# EAGLE schematic FridgeExtender (EAGLE 9.7.0)
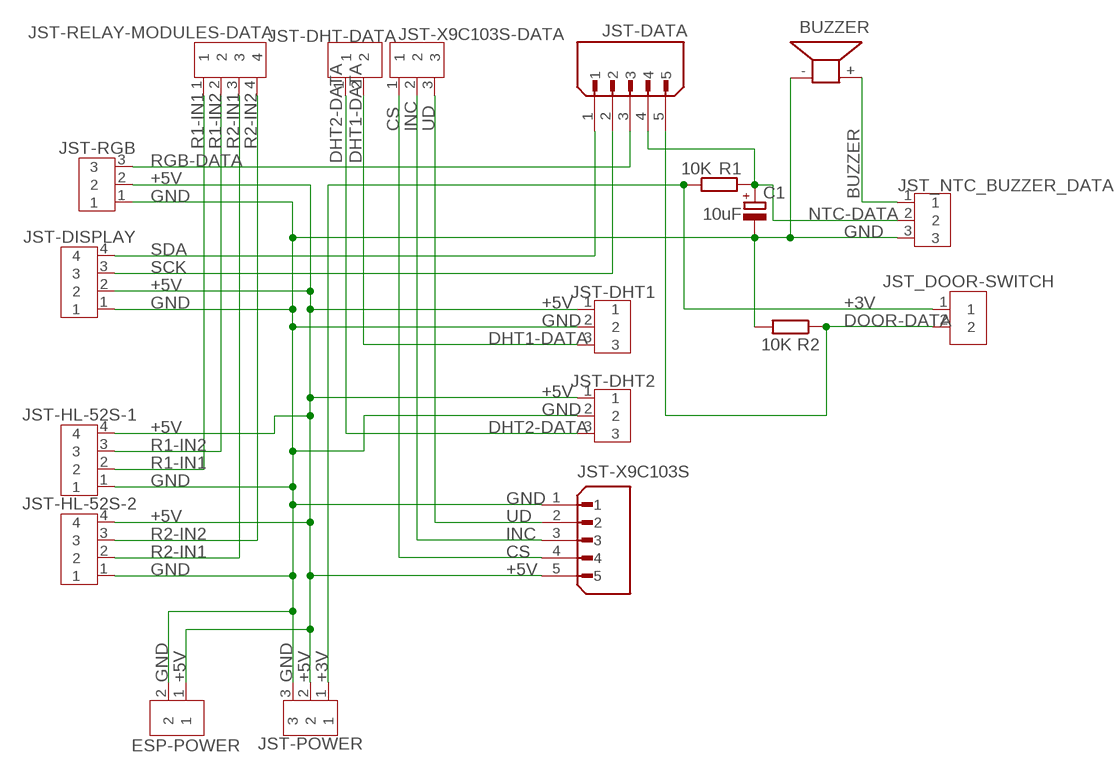
[diagram p0: schematic, sheet 1]

## Parts
BUZZER  AL11P  [AL11P]
C1  10uF  C-POL_RADIAL-11MM-DIA  [CAPPRD508W65D1000H1100B]
ESP-POWER  B2B-XH-A  [B2B-XH-A]
JST-DATA  B5B-XH-A(LF)(SN)  [JST_B5B-XH-A(LF)(SN)]
JST-DHT1  B3B-XH-A  [B3B-XH-A]
JST-DHT2  B3B-XH-A  [B3B-XH-A]
JST-DHT-DATA  B2B-XH-A  [B2B-XH-A]
JST-DISPLAY  B4B-XH-A  [B4B-XH-A]
JST-HL-52S-1  B4B-XH-A  [B4B-XH-A]
JST-HL-52S-2  B4B-XH-A  [B4B-XH-A]
JST-POWER  B3B-XH-A  [B3B-XH-A]
JST-RELAY-MODULES-DATA  B4B-XH-A  [B4B-XH-A]
JST-RGB  B3B-XH-A  [B3B-XH-A]
JST-X9C103S  B5B-XH-A(LF)(SN)  [JST_B5B-XH-A(LF)(SN)]
JST-X9C103S-DATA  B3B-XH-A  [B3B-XH-A]
JST_DOOR-SWITCH  B2B-XH-A  [B2B-XH-A]
JST_NTC_BUZZER_DATA  B3B-XH-A  [B3B-XH-A]
R1  10K  R_AXIAL-7.2MM-PITCH  [RESAD724W46L381D178B]
R2  10K  R_AXIAL-7.2MM-PITCH  [RESAD724W46L381D178B]

## Nets
+3V: JST-POWER.1 JST_DOOR-SWITCH.1 R1.1
+5V: ESP-POWER.1 JST-DHT1.1 JST-DHT2.1 JST-DISPLAY.2 JST-HL-52S-1.4 JST-HL-52S-2.4 JST-POWER.2 JST-RGB.2 JST-X9C103S.5
BUZZER: BUZZER.+ JST_NTC_BUZZER_DATA.1
CS: JST-X9C103S-DATA.1 JST-X9C103S.4
DHT1-DATA: JST-DHT1.3 JST-DHT-DATA.2
DHT2-DATA: JST-DHT2.3 JST-DHT-DATA.1
DOOR-DATA: JST-DATA.5 JST_DOOR-SWITCH.2 R2.1
GND: BUZZER.- C1.2(-) ESP-POWER.2 JST-DHT1.2 JST-DHT2.2 JST-DISPLAY.1 JST-HL-52S-1.1 JST-HL-52S-2.1 JST-POWER.3 JST-RGB.1 JST-X9C103S.1 JST_NTC_BUZZER_DATA.3 R2.2
INC: JST-X9C103S-DATA.2 JST-X9C103S.3
NTC-DATA: C1.1(+) JST-DATA.4 JST_NTC_BUZZER_DATA.2 R1.2
R1-IN1: JST-HL-52S-1.2 JST-RELAY-MODULES-DATA.1
R1-IN2: JST-HL-52S-1.3 JST-RELAY-MODULES-DATA.2
R2-IN1: JST-HL-52S-2.2 JST-RELAY-MODULES-DATA.3
R2-IN2: JST-HL-52S-2.3 JST-RELAY-MODULES-DATA.4
RGB-DATA: JST-DATA.3 JST-RGB.3
SCK: JST-DATA.2 JST-DISPLAY.3
SDA: JST-DATA.1 JST-DISPLAY.4
UD: JST-X9C103S-DATA.3 JST-X9C103S.2

## Library data of the parts
BUZZER = buzzer:AL11P: SPEAKER Source: Buerklin; OC_FARNELL: unknown; OC_NEWARK: unknown
C1 = Capacitor:C-POL: Capacitor Polarised - Generic; CATEGORY: Capacitor
ESP-POWER JST-DHT-DATA JST_DOOR-SWITCH = Connector:B2B-XH-A: XH Connector Top Entry - 2POS Details see: Datasheet <http://www.jst-mfg.com/product/pdf/eng/eXH.pdf>; CATEGORY: Header; DESCRIPTION: Connector Header Through Hole 2 position 0.098" (2.50mm); MANUFACTURER: JST Sales America Inc.; MPN: B2B-XH-A(LF)(SN); OPERATING_TEMPERATURE: -25°C ~ 85°C; PART_STATUS: ACTIVE; PITCH: 0.098" (2.50mm); ROHS_COMPLIANCE: ROHS3 Compliant; SERIES: XH; SUB_CATEGORY: Rectangular Connectors; TYPE: Header, Male Pin, Board to Cable/Wire, Through Hole
JST-DATA JST-X9C103S = B5B-XH-A_LF__SN_:B5B-XH-A(LF)(SN): Check availability <https://pricing.snapeda.com/parts/B5B-XH-A%28LF%29%28SN%29/JST%20Sales%20America%20Inc./view-part?ref=eda>; AVAILABILITY: In Stock; CHECK_PRICES: https://www.snapeda.com/parts/B5B-XH-A(LF)(SN)/JST+Sales+America+Inc./view-part/?ref=eda; DESCRIPTION: Connector Header Through Hole 5 position 0.098 (2.50mm); MF: JST Sales America Inc.; MP: B5B-XH-A(LF)(SN); PACKAGE: None; PRICE: None; SNAPEDA_LINK: https://www.snapeda.com/parts/B5B-XH-A(LF)(SN)/JST+Sales+America+Inc./view-part/?ref=snap
JST-DHT1 JST-DHT2 JST-POWER JST-RGB JST-X9C103S-DATA JST_NTC_BUZZER_DATA = Connector:B3B-XH-A: XH Connector Top Entry - 3POS Details see: Datasheet <http://www.jst-mfg.com/product/pdf/eng/eXH.pdf>; CATEGORY: Header; DESCRIPTION: Connector Header Through Hole 3 position 0.098" (2.50mm); MANUFACTURER: JST Sales America Inc.; MPN: B3B-XH-A(LF)(SN); PART_STATUS: ACTIVE; PITCH: 0.098" (2.50mm); ROHS_COMPLIANCE: ROHS3 Compliant; SERIES: XH; SUB_CATEGORY: Rectangular Connectors; TYPE: Header, Male Pin, Board to Cable/Wire, Through Hole
JST-DISPLAY JST-HL-52S-1 JST-HL-52S-2 JST-RELAY-MODULES-DATA = Connector:B4B-XH-A: XH Connector Top Entry - 4POS Details see: Datasheet <http://www.jst-mfg.com/product/pdf/eng/eXH.pdf>; CATEGORY: Header; DSECRIPTION: Connector Header Through Hole 4 position 0.098" (2.50mm); MANUFACTURER: JST Sales America Inc.; MPN: B4B-XH-A(LF)(SN); OPERATING_TEMPERATURE: -25 C to 85 C; PART_STATUS: ACTIVE; PITCH: 0.098" (2.50mm); ROHS_COMPLIANCE: ROHS3 Compliant; SERIES: XH; SUB_CATEGORY: Rectangular Connectors; TYPE: Header, Male Pin, Board to Cable/Wire, Through Hole
R1 R2 = Resistor:R: Resistor Fixed - Generic; CATEGORY: Resistor; SUB-CATEGORY: Fixed